# Altium schematic sheet Sheet13.SchDoc
size A4
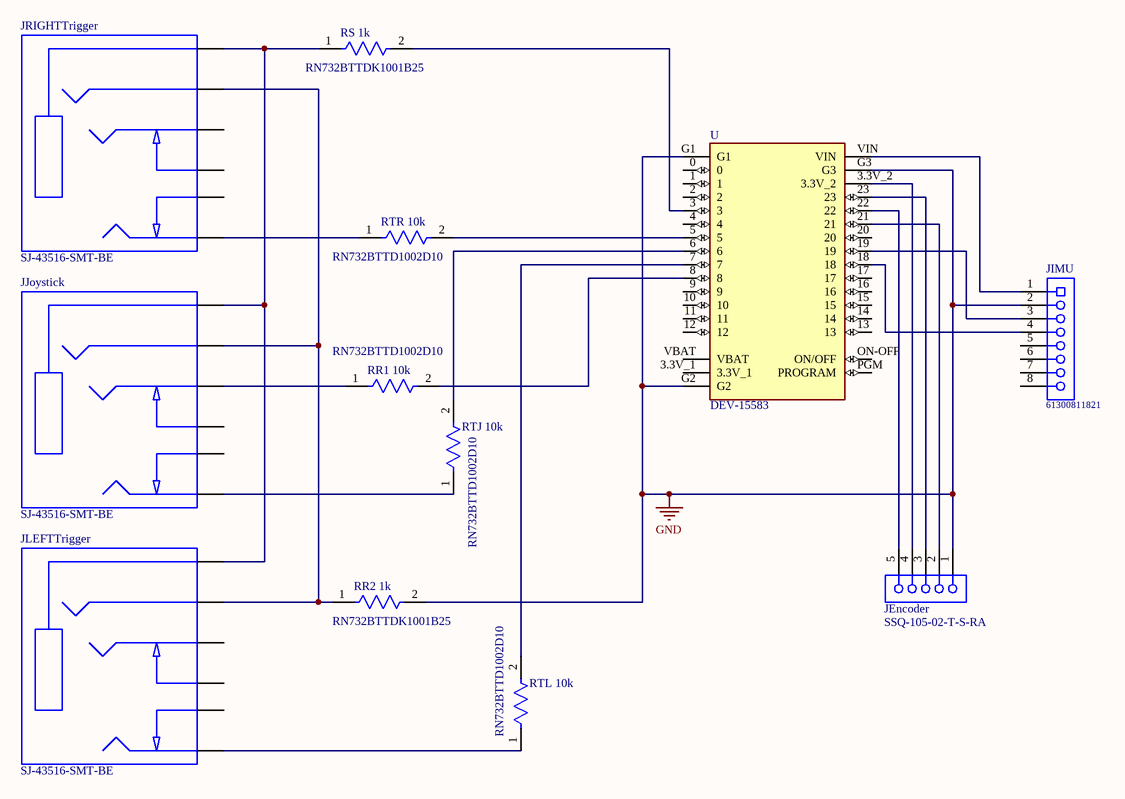
[diagram p0: Sheet13.SchDoc]

## Parts
JEncoder  SSQ-105-02-T-S-RA  [SMTC-SSQ-105-02-X-S-RA]
JIMU  61300811821  [61300811821]
JJoystick  SJ-43516-SMT-BE  [CUI_SJ-43516-SMT-BE]
JLEFTTrigger  SJ-43516-SMT-BE  [CUI_SJ-43516-SMT-BE]
JRIGHTTrigger  SJ-43516-SMT-BE  [CUI_SJ-43516-SMT-BE]
RR1_10k  RN732BTTD1002D10  [FP-RN732B-IPC_B]
RR2_1k  RN732BTTDK1001B25  [FP-RN732B-IPC_C]
RS_1k  RN732BTTDK1001B25  [FP-RN732B-IPC_C]
RTJ_10k  RN732BTTD1002D10  [FP-RN732B-IPC_B]
RTL_10k  RN732BTTD1002D10  [FP-RN732B-IPC_B]
RTR_10k  RN732BTTD1002D10  [FP-RN732B-IPC_B]
U  DEV-15583  [MODULE_DEV-15583]

## Nets
GND: JEncoder.1 JIMU.2 RR2_1k.2 U.G1 U.G2 U.G3
NetJEncoder_2: JEncoder.2 U.21
NetJEncoder_3: JEncoder.3 U.23
NetJEncoder_4: JEncoder.4 U.3.3V_2
NetJEncoder_5: JEncoder.5 U.22
NetJIMU_1: JIMU.1 U.VIN
NetJIMU_3: JIMU.3 U.19
NetJIMU_4: JIMU.4 U.18
NetJJoystick_1: JJoystick.1(SLEEVE) JLEFTTrigger.1(SLEEVE) JRIGHTTrigger.1(SLEEVE) RS_1k.1
NetJJoystick_2: JJoystick.2(TIP) RTJ_10k.1
NetJJoystick_3: JJoystick.3(RING1) RR1_10k.1
NetJJoystick_4: JJoystick.4(RING2) JLEFTTrigger.4(RING2) JRIGHTTrigger.4(RING2) RR2_1k.1
NetJLEFTTrigger_2: JLEFTTrigger.2(TIP) RTL_10k.1
NetJRIGHTTrigger_2: JRIGHTTrigger.2(TIP) RTR_10k.1
NetRR1_10k_2: RR1_10k.2 U.8
NetRS_1k_2: RS_1k.2 U.3
NetRTJ_10k_2: RTJ_10k.2 U.6
NetRTL_10k_2: RTL_10k.2 U.7
NetRTR_10k_2: RTR_10k.2 U.5

Not connected (* = marked no-connect by the designer): JIMU 5 6 7 8; JJoystick 5(TIP_SWITCH) 6(RING_SWITCH); JLEFTTrigger 3(RING1) 5(TIP_SWITCH) 6(RING_SWITCH); JRIGHTTrigger 3(RING1) 5(TIP_SWITCH) 6(RING_SWITCH); U 0 1 2 3.3V_1 4 9 10 11 12 13 14 15 16 17 20 ON-OFF(ON/OFF) PGM(PROGRAM) VBAT

## Library data of the parts
JEncoder = CMP-1023-00281-1: SQ Post Socket, Through-hole, Right Angle, -55 to 105 degC, 2.54 mm Pitch, 5-Pin, Female, RoHS; Manufacturer: Samtec; Pitch: 2.54 mm; ComponentLink1URL: http://www.samtec.com; ComponentLink2Description: Datasheet; ComponentLink3URL: http://www.samtec.com/documents/webfiles/cpdf/SSQ-1XX-XX-XXX-X-XX-XXX-XX-X-MKT.pdf; DatasheetVersion: F-214; ComponentLink1Description: Manufacturer URL; Mounting Technology: Through-hole; ComponentLink2URL: http://www.samtec.com/documents/webfiles/pdf/SSQ_TH.PDF; PackageVersion: BD, 6/1987; ComponentLink3Description: Package Specification; RoHS: True; PackageReference: SSQ-105-02-X-S-RA; Orientation: Right Angle; PartNumber: SSQ-105-02-T-S-RA; Temperature Range: -55 to 105 degC; PackageDescription: Assembly, Socket Strip .025[0.64] SQ Tail
JIMU = CMP-1502-01327-1: THT Vertical Socket Header WR-PHD, Pitch 2.54 mm, Single Row, 8 pins; Manufacturer: Wurth Elektronik; Gender: Female; Pin Number: 8; Withstanding Voltage: 500VAC; Pitch: 2.54mm; Contact Resistance: 20mOhm; Working Voltage: 250VAC; Rated Current: 3A; Mounting Technology: THT; Manufacturer URL: http://www.we-online.de; Package Reference: 61300811821; Orientation: Vertical; Datasheet URL: https://katalog.we-online.de/em/datasheet/6130xx11821.pdf; Row Number: Single; Packaging: Tray; Part Number: 61300811821; Publisher: WurthElektronik; Operating Temperature: -40to125degC
JJoystick JLEFTTrigger JRIGHTTrigger = SJ-43516-SMT-BE: 3.5 mm, 4 Conductors, Right Angle, Surface Mount _SMT_, Audio Jack Connector; MP: SJ-43516-SMT-TR-BE; MF: CUI Devices; SnapEDA_Link: https://www.snapeda.com/parts/SJ-43516-SMT-TR-BE/CUI%20Devices/view-part/490913/?ref=snap; Package: None; Availability: Unavailable; Price: None; Value: *
RR1_10k RTJ_10k RTL_10k RTR_10k = CMP-04015-044241-1: 10kΩ ±0.5% 0.125W, 1/8W Chip Resistor 1206 (3216 Metric) Moisture Resistant Thin Film; Power Rating: 125mW; Voltage Rating: 150V; Resistance: 10kR; Temperature Coefficient: 10ppm/°C; Termination: SMD/SMT; Package Quantity: 5000; Height: 0.6mm; Composition: Thin Film; Packaging: Tape and Reel; Max Operating Temperature: 125°C; Min Operating Temperature: -55°C; Case Code (Metric): 3216; Case Code (Imperial): 1206; Tolerance: 0.5%; Width: 1.6mm; Case/Package: 1206; Length: 3.2mm
RR2_1k RS_1k = CMP-04015-036806-1: 1kΩ ±0.1% 0.125W, 1/8W Chip Resistor 1206 (3216 Metric) Moisture Resistant Thin Film; Voltage Rating (DC): 150V; Power Rating: 125mW; Temperature Coefficient: 25ppm/°C; Resistance: 1kR; Composition: Thin Film; Width: 1.6mm; Case Code (Metric): 3216; Weight: 0.000571oz; Tolerance: 0.1%; Length: 3.2mm; Voltage Rating: 150V; Height: 0.6mm; Packaging: Tape and Reel; Max Operating Temperature: 125°C; Min Operating Temperature: -55°C; Case Code (Imperial): 1206; Case/Package: 1206; Termination: SMD/SMT
U = DEV-15583: RT1062 Teensy 4.0 i.MX ARMÂ® CortexÂ®-M7 MPU Embedded Evaluation Board; MF: SparkFun Electronics; Value: *; Package: None; Digi-Key_Part_Number: 1568-DEV-15583-ND; Digi-Key_Purchase_URL: https://www.digikey.com/product-detail/en/sparkfun-electronics/DEV-15583/1568-DEV-15583-ND/10384551?utm_source=snapeda&utm_medium=aggregator&utm_campaign=symbol; MP: DEV-15583; SnapEDA_Link: https://www.snapeda.com/parts/DEV-15583/SparkFun%20Electronics/view-part/4001229/?ref=snap